# EAGLE design PCB-DISP256x64_ (EAGLE 7.5.0)

## Sheet 1 of 2
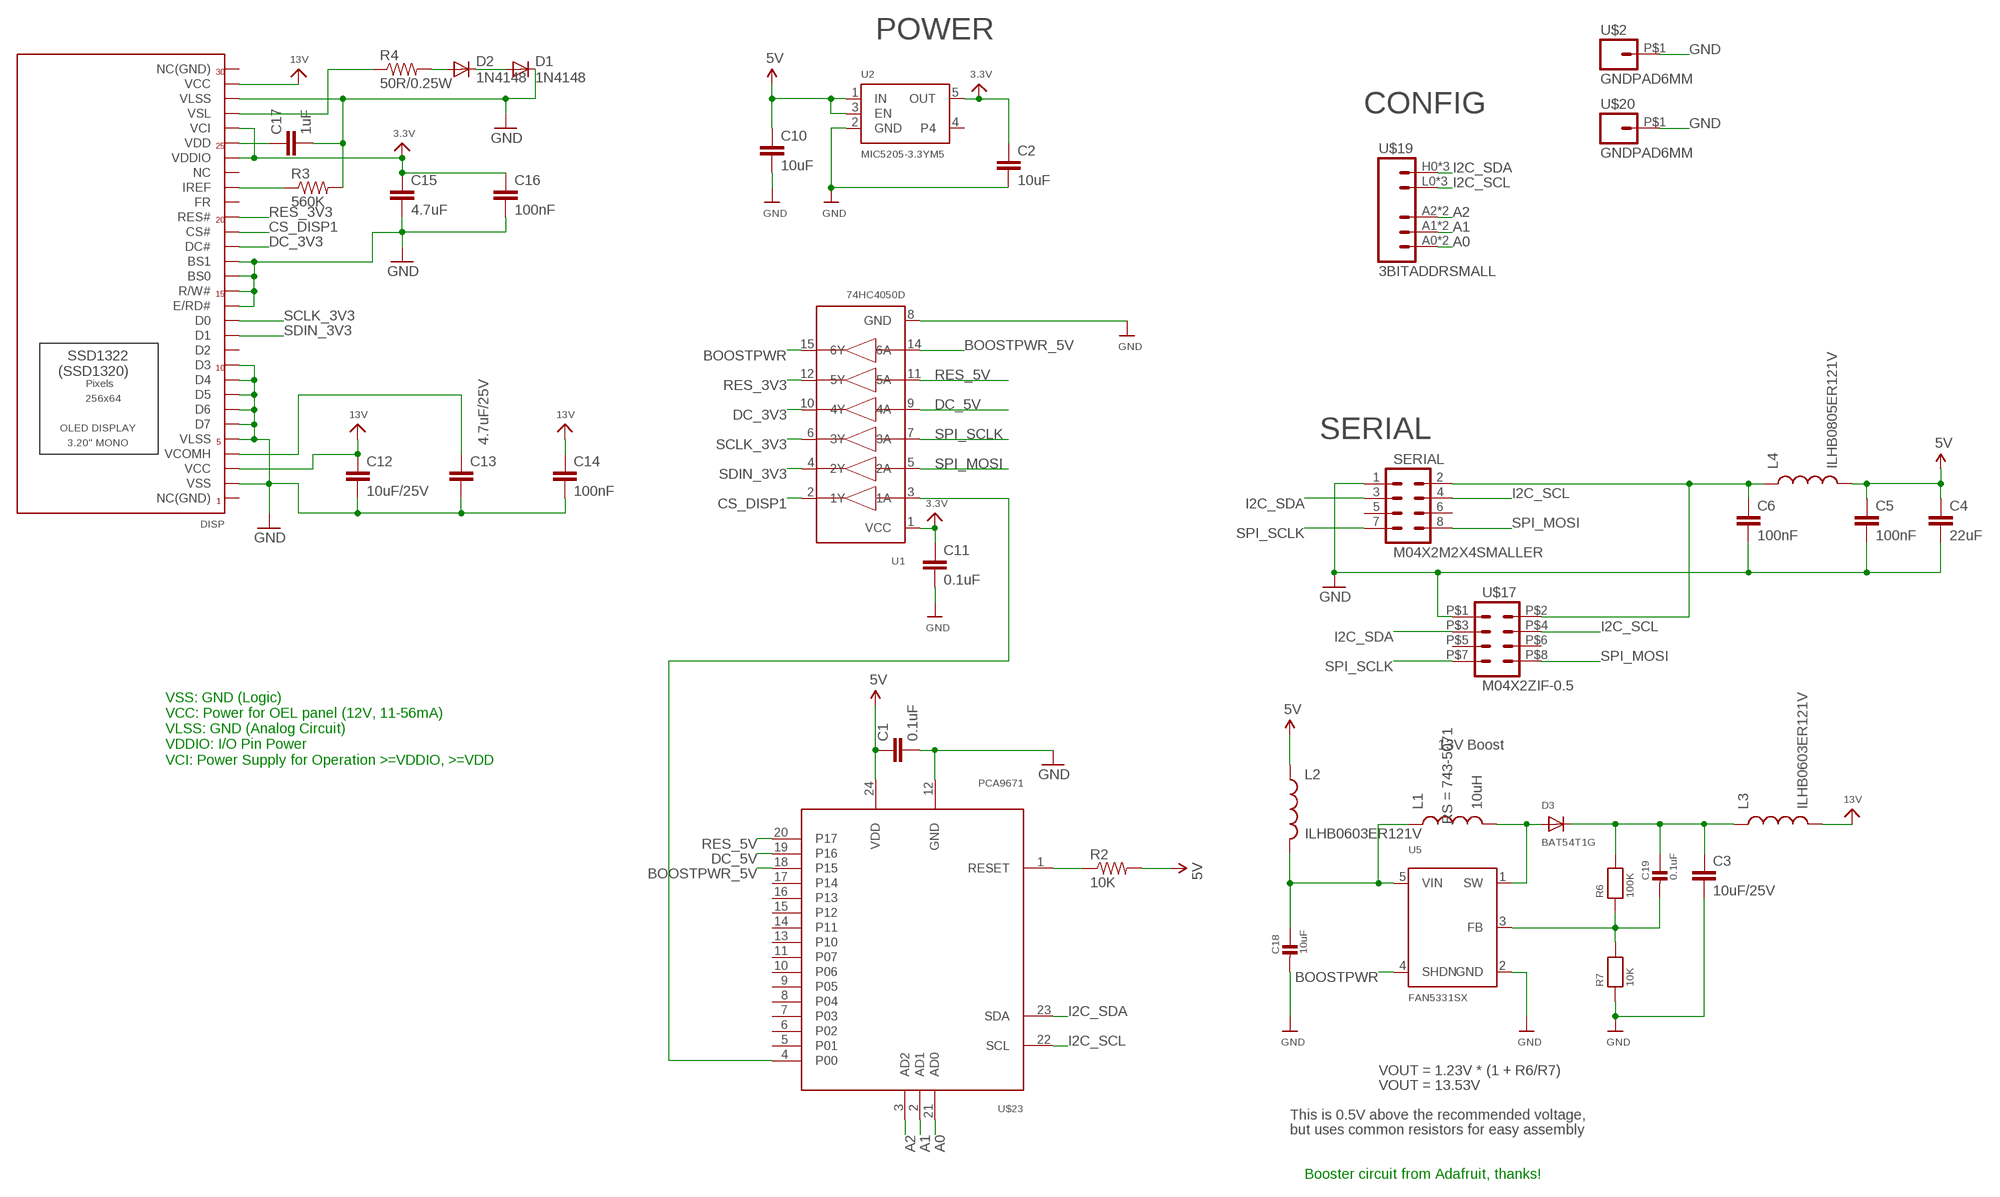
[diagram p0: schematic, sheet 1]

### Parts
C1  0.1uF  CAP0603-CAP  [0603-CAP]
C2  10uF  CAP0805  [0805]
C3  10uF/25V  CAP0805  [0805]
C4  22uF  CAP0805  [0805]
C5  100nF  CAP0603-CAP  [0603-CAP]
C6  100nF  CAP0603-CAP  [0603-CAP]
C10  10uF  CAP0805  [0805]
C11  0.1uF  CAP0603-CAP  [0603-CAP]
C12  10uF/25V  CAP0805  [0805]
C13  4.7uF/25V  CAP0805  [0805]
C14  100nF  CAP0603-CAP  [0603-CAP]
C15  4.7uF  CAP0805  [0805]
C16  100nF  CAP0603-CAP  [0603-CAP]
C17  1uF  CAP0603-CAP  [0603-CAP]
C18  10uF  CAP_CERAMIC0805  [0805]
C19  0.1uF  CAP_CERAMIC0603  [0603]
D1  1N4148  DIODESOD  [SOD-323]
D2  1N4148  DIODESOD  [SOD-323]
D3  BAT54T1G  DIODESOD-123  [SOD-123]
DISP  ER_OLED032-1TOP  [FPC_XF2M-3015-1A]
L1  10uH  POWERINDUCTOR  [3015]
L2  ILHB0603ER121V  INDUCTOR0603  [0603]
L3  ILHB0603ER121V  INDUCTOR0603  [0603]
L4  ILHB0805ER121V  INDUCTOR0805  [0805]
R2  10K  RESISTOR0603-RES  [0603-RES]
R3  560K  RESISTOR0603-RES  [0603-RES]
R4  50R/0.25W  RESISTOR0603-RES  [0603-RES]
R6  100K  RESISTOR0603  [0603]
R7  10K  RESISTOR0603  [0603]
SERIAL  M04X2M2X4SMALLER  [M2X4SMALLER]
U1  74HC4050D  74HC4050DTSSOP16  [TSSOP16]
U2  MIC5205-3.3YM5  VREG_SOT23-5  [SOT23-5]
U5  FAN5331SX  FAN5331  [SOT23-5@1]
U$2  GNDPAD6MM  [3.2MMPAD6MM]
U$17  M04X2ZIF-0.5  [ZIP-8-0.5]
U$19  3BITADDRSMALL  [3BITADDR_SMALL]
U$20  GNDPAD6MM  [3.2MMPAD6MM]
U$23  PCA9671  [TSSOP24]

### Nets
3.3V [Power]: C2.1 C11.1 C15.1 C16.1 DISP.P$5(VCI) DISP.P$7(VDDIO) U1.1(VCC) U2.5(OUT)
5V [Power]: C1.1 C4.1 C5.1 C10.1 L2.1 L4.2 R2.2 U2.1(IN) U2.3(EN) U$23.24(VDD)
13V [Power]: C12.1 C14.1 DISP.P$2(VCC) DISP.P$28(VCC) L3.2
A0: U$19.A0 U$19.AS0(A0) U$23.21(AD0)
A1: U$19.A1 U$19.AS1(A1) U$23.2(AD1)
A2: U$19.A2 U$19.AS2(A2) U$23.3(AD2)
ARD_5V [Power]: C6.1 L4.1 SERIAL.2 U$17.P$2
BOOSTPWR: U1.15(6Y) U5.4(SHDN)
BOOSTPWR_5V [Power]: U1.14(6A) U$23.18(P15)
CS_DISP1: DISP.P$12(CS#) U1.2(1Y)
DC_3V3: DISP.P$13(DC#) U1.10(4Y)
DC_5V: U1.9(4A) U$23.19(P16)
GND [Power]: C1.2 C2.2 C3.2 C4.2 C5.2 C6.2 C10.2 C11.2 C12.2 C13.2 C14.2 C15.2 C16.2 C17.2 C18.2 D1.1(C) DISP.P$3(VLSS) DISP.P$14(BS1) DISP.P$15(BS0) DISP.P$16(R/W#) DISP.P$17(E/RD#) DISP.P$21(D3) DISP.P$22(D4) DISP.P$23(D5) DISP.P$24(D6) DISP.P$25(D7) DISP.P$26(VLSS) DISP.P$29(VSS) R3.2 R7.1 SERIAL.1 U1.8(GND) U2.2(GND) U5.2(GND) U$2.P$1 U$17.P$1 U$20.P$1 U$23.12(GND)
I2C_SCL: SERIAL.4 U$17.P$4 U$19.L0(GND) U$19.L1(GND) U$19.L2(GND) U$23.22(SCL)
I2C_SDA: SERIAL.3 U$17.P$3 U$19.H0(VCC) U$19.H1(VCC) U$19.H2(VCC) U$23.23(SDA)
N$1: R2.1 U$23.1(RESET)
N$2 [Power]: C18.1 L1.1 L2.2 U5.5(VIN)
N$3: U1.3(1A) U$23.4(P00)
N$4: C3.1 C19.1 D3.C L3.1 R6.2
N$5: C13.1 DISP.P$27(VCOMH)
N$6: DISP.P$4(VSL) R4.1
N$10: DISP.P$9(IREF) R3.1
N$11: D2.2(A) R4.2
N$12: C17.1 DISP.P$6(VDD)
N$13: D1.2(A) D2.1(C)
N$14 [BoostPower]: D3.A L1.2 U5.1(SW)
N$15: C19.2 R6.1 R7.2 U5.3(FB)
RES_3V3: DISP.P$11(RES#) U1.12(5Y)
RES_5V: U1.11(5A) U$23.20(P17)
SCLK_3V3: DISP.P$18(D0) U1.6(3Y)
SDIN_3V3: DISP.P$19(D1) U1.4(2Y)
SPI_MOSI: SERIAL.8 U1.5(2A) U$17.P$8
SPI_SCLK: SERIAL.7 U1.7(3A) U$17.P$7
Unconnected: DISP.P$1(NC(GND)) DISP.P$8(NC) DISP.P$10(FR) DISP.P$20(D2) DISP.P$30(NC(GND)) SERIAL.5 SERIAL.6 U2.4 U$17.P$5 U$17.P$6 U$23.5(P01) U$23.6(P02) U$23.7(P03) U$23.8(P04) U$23.9(P05) U$23.10(P06) U$23.11(P07) U$23.13(P10) U$23.14(P11) U$23.15(P12) U$23.16(P13) U$23.17(P14)

### Notes on the sheet
- POWER
- CONFIG
- SERIAL
- 13V Boost
- VSS: GND (Logic)
  VCC: Power for OEL panel (12V, 11-56mA)
  VLSS: GND (Analog Circuit)
  VDDIO: I/O Pin Power
  VCI: Power Supply for Operation >=VDDIO, >=VDD
- VOUT = 1.23V * (1 + R6/R7)
- VOUT = 13.53V
- This is 0.5V above the recommended voltage,
- but uses common resistors for easy assembly
- Booster circuit from Adafruit, thanks!

## Sheet 2 of 2

## Library data of the parts
C1-C6 C10-C17 = SparkFun:CAP: Capacitor Standard 0603 ceramic capacitor, and 0.1" leaded capacitor.
C18 C19 = microbuilder:CAP_CERAMIC: Ceramic Capacitors For new designs, use the packages preceded by an '_' character since they are more reliable: The following footprints should be used on most boards: _0402 - Standard footprint for regular board layouts _0603 - Standard footprint for regular board layouts _0805 - Standard footprint for regular board layouts For extremely tight-pitch boards where space is at a premium, the following 'micro-pitch' footprints can be used (smaller pads, no silkscreen outline, etc.): _0402MP - Micro-pitch footprint for very dense/compact boards _0603MP - Micro-pitch footprint for very dense/compact boards _0805MP - Micro-pitch footprint for very dense/compact boards Commonly Stocked Parts 0402 - 0402 Surface Mount Capacitors 16pF 50V 5% [Digikey: 445-4899-2-ND] 18pF 50V 5% [Digikey: 490-1281-2-ND] 22pF 50V 5% [Digikey: 490-1283-2-ND] 68pF 50V 5% [Digikey: 490-1289-2-ND] 0.1uF 10V 10% [Digikey: 490-1318-2-ND] 1.0uF 6.3V 10% [Digikey: 490-1320-2-ND] 0603 - 0603 Surface Mount Capacitors 16 pF 50V 5% [Digikey: 445-5051-2-ND] 22 pF 50V [Digikey: PCC220ACVTR-ND] 33 pF 50V 5% [Digikey: 490-1415-1-ND] 56pF 50V 5% [Digikey: 490-1421-1-ND] 220pF 50V 5% [Digikey: 445-1285-1-ND] 680 pF 50V 2200 pF 50V 5% C0G [Digikey: 445-1297-1-ND] 5600 pF 100V 5% X7R [Digikey: 478-3711-1-ND] 0.1 µF 25V 10% [Digikey: PCC2277TR-ND] 0.22 µF 16V 10% X7R [Digikey: 445-1318-1-ND] 1.0 µF 25V 10% [Digikey: 445-5146-2-ND] 0603 - RF Specific 3pF 250V +/-0.1pF RF [Digikey: 712-1347-1-ND] 18 pF 250V 5% [Digikey: 478-3505-1-ND or 712-1322-1-ND] 56 pF 250V 5% C0G RF [Digikey: 490-4867-1-ND] 68 pF 250V RF [Digikey: 490-4868-1-ND] 0805 - 0805 Surface Mount Capacitors 220 pF 250V 2% RF Ceramic Capacitor [Digikey: 712-1398-1-ND] 1000 pF 50V 2% NP0 Ceramic Capacitor [Digikey: 478-3760-1-ND] 0.1 µF 25V 10% Ceramic Capacitor [Digikey: PCC1828TR-ND] 1.0 µF 16V 10% Ceramic Capacitor[Digikey: 490-1691-2-ND] 10.0 µF 10V 10% Ceramic Capacitor[Digikey: 709-1228-1-ND] 10.0 uF 16V 10% Ceramic Capacitor [Digikey: 478-5165-2-ND] 47 uF 6.3V 20% Ceramic Capacitor [Digikey: 587-1779-1-ND or 399-5506-1-ND] 1206 - 1206 Surface Mount Capacitors 47uF 10V 20% Ceramic Capacitor [Digikey: 490-5528-1-ND or 399-5508-1-ND or 445-6010-1-ND] 100uF 6.3V -20%, +80% Y5V Ceramic Capacitor (Digikey: 490-4512-1-ND, Mouser: 81-GRM31CF50J107ZE1L)
D1 D2 = SparkFun:DIODE: Diode
D3 = microbuilder:DIODE: Diode
DISP = SKAARHOJ:ER_OLED032-1: 128x128 1.5" RGB OLED - UG-2828GDEDF11 30-Pin 0.5mm Pitch FPC Cable (Top+Bottom Contacts) - OMRON XF2M-3015-1A (Digikey: OR723TR-ND) This FPC connector has contacts on the top and bottom, but the appropriate pin needs to be selected depending on whether the OLED will be inserted right-side up (use the TOP pinout) or upside-down (use the BOTTOM pinout).
L1 = SKAARHOJ:POWERINDUCTOR; RS: 743-5071
L2-L4 = SparkFun:INDUCTOR: Inductors Basic Inductor/Choke - 0603 and 1206. Footprints are not proven and vary greatly between part numbers.
R2-R4 = SparkFun:RESISTOR: Resistor Basic schematic elements and footprints for 0603, 1206, and PTH resistors.
R6 R7 = microbuilder:RESISTOR: Resistors For new designs, use the packages preceded by an '_' character since they are more reliable: The following footprints should be used on most boards: _0402 - Standard footprint for regular board layouts _0603 - Standard footprint for regular board layouts _0805 - Standard footprint for regular board layouts For extremely tight-pitch boards where space is at a premium, the following 'micro-pitch' footprints can be used (smaller pads, no silkscreen outline, etc.): _0402MP - Micro-pitch footprint for very dense/compact boards _0603MP - Micro-pitch footprint for very dense/compact boards _0805MP - Micro-pitch footprint for very dense/compact boards
SERIAL U$17 = SKAARHOJ:M04X2
U1 = SKAARHOJ:74HC4050D: 6-channel level shifter 74HC4050D - 2V-6V Supply Digikey: 74HC4050D,653-ND Mouser: 771-74HC4050D-T
U2 = microbuilder:VREG_SOT23-5: SOT23-5 Fixed Voltage Regulators To better organise some of the SOT23-5 fixed voltage regulators in this library, this new part was created. Part Current Out V Out V In V Dropout Digikey Part No. ADP121 150mA 3.3V 3.4-5.5V 0.09V @ 150mA ADP121-AUJZ33R7CT-ND ADP121 150mA 3.0V 3.1-5.5V 0.09V @ 150mA ADP121-AUJZ30R7CT-ND ADP122 300mA 3.3V 3.4-5.5V 0.085V @ 300mA ADP122AUJZ-3.3-R7CT-ND ADP1712 300mA 3.3V 3.5-5.5V 0.17V @ 300mA ADP1712AUJZ-3.3-R7TR-ND AP7311 (Low Cost) 150mA 3.3V 3.5-6V 0.15V @ 150mA AP7311-33WG-7DICT-ND LD39015M18R 150mA 1.8V 1.9V-5.5V 0.08V @ 100mA 497-6977-1-ND MCP1824T-3302E/OT 300mA 3.3V 3.5V-6V 0.2V @ 300mA MCP1824T-3302E/OTCT-ND MIC5205-2.5YM5 TR 150mA 2.5V 2.7-16V 0.165V @ 150mA 576-1257-2-ND MIC5205-3.0YM5 TR 150mA 3.0V 3.2V-16V 0.165V @ 150mA 576-1258-2-ND MIC5205-3.3YM5 TR 150mA 3.3V 3.5V-16V 0.165V @ 150mA 576-1259-2-ND TPS780330220 150mA 3.3V+2.2V 3.6-5.5V 250mV Max 296-23332-1-ND TDA3663/N1,135 100mA 3.3V 3.5-45V 0.18V @ 50mA 568-5343-1-ND
U5 = microbuilder:FAN5331: FAN5331 - LED/OLED 20V Boost Converter Digikey: FAN5331SXCT-ND
U$2 U$20 = SKAARHOJ:GNDPAD
U$19 = SKAARHOJ:3BITADDR
U$23 = SKAARHOJ:PCA9671

## Net classes
0 default: width 0.203 mm, drill 0.406 mm, clearance 0.152 mm
1 Power: width 0.305 mm, drill 0.61 mm, clearance 0.152 mm
2 BoostPower: width 0.61 mm, drill 0.61 mm, clearance 0.305 mm

## Board
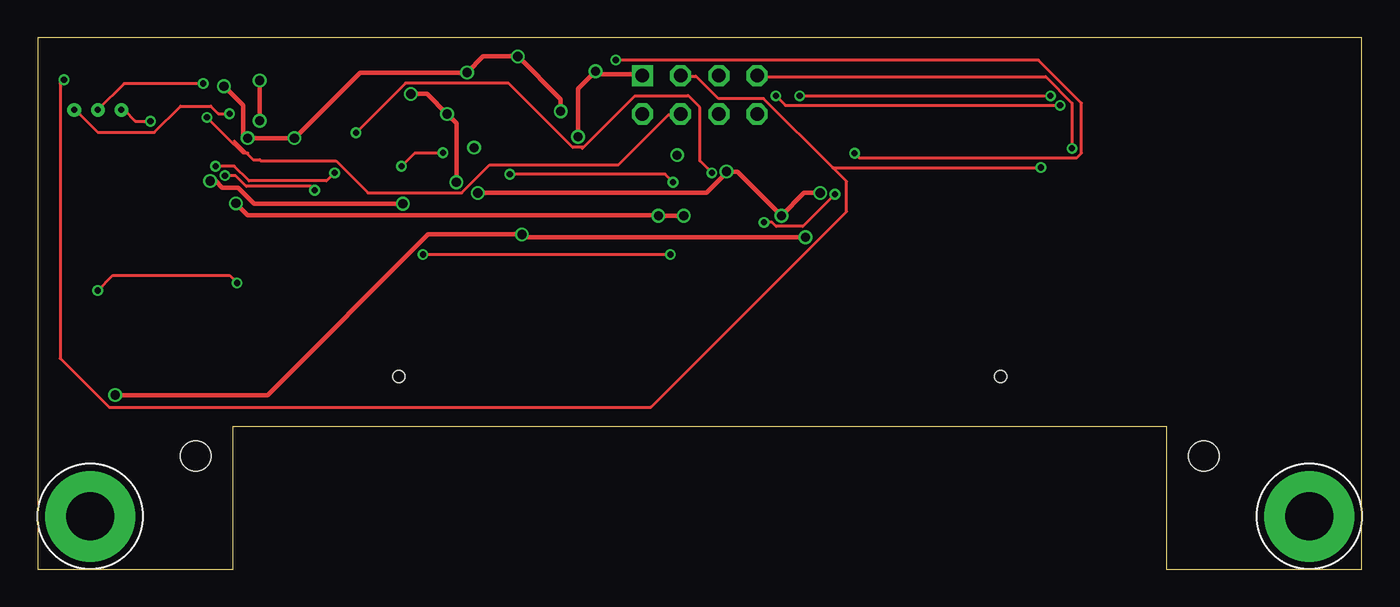
[diagram p1: board, top side]
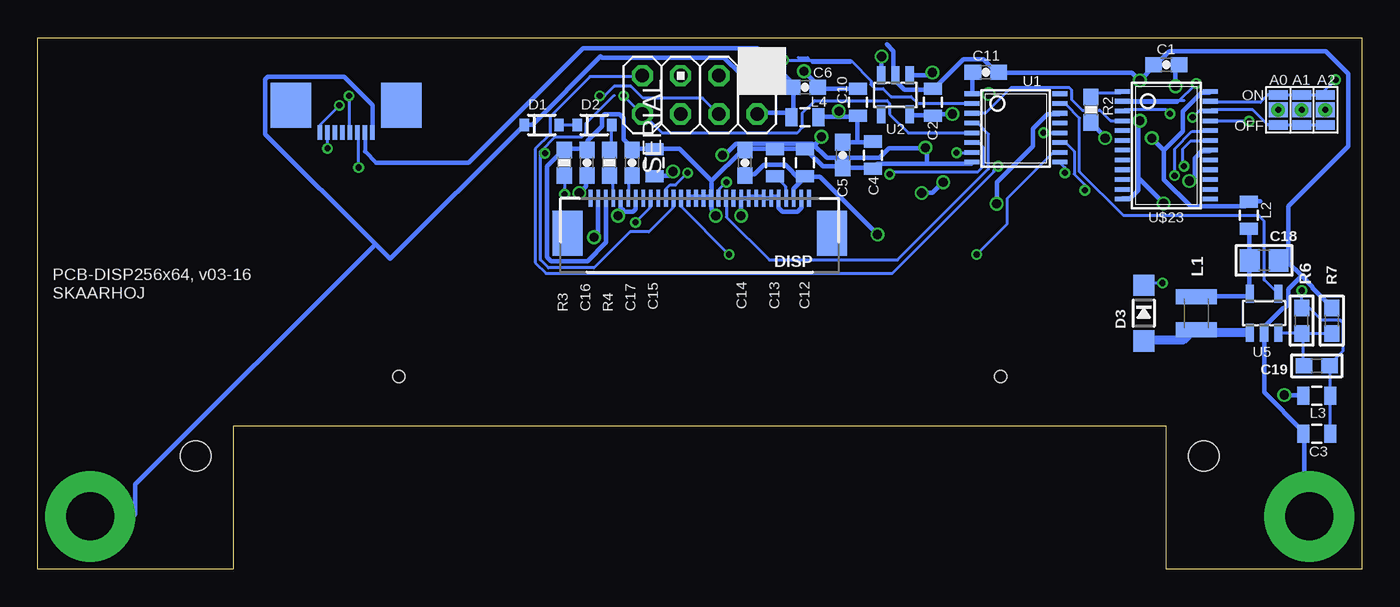
[diagram p2: board, bottom side, seen from below]

Size 88 x 35.3 mm. Coordinates in mm from the lower left corner, seen from the top.
Outline: 88,0 88,35.3 0,35.3 0,0 13,0 13,9.5 75,9.5 75,0 88,0
Copper layers (1*16): Top 0.035mm / dielectric 1.5mm / Bottom 0.035mm
Design rules "Fusion_eagle_rule_v1.1": minimum track width 6mil, minimum drill 12mil, track to track 6mil, track to pad 6mil, pad to pad 6mil, via to via 6mil, smd to smd 0mil, copper to edge 10mil, drill to drill 10mil, minimum pad ring 10mil, minimum via ring 6mil, stop-mask expansion 2mil, vias tented up to drill 100mil, thermal gap 10mil
Holes 0.8 mm at 24,12.8 64,12.8
Holes 2 mm at 10.5,7.5 77.5,7.5
tRestrict: area 9.5,14.5 to 12.5,19
bRestrict: area 9.5,14.5 to 12.5,19

### Footprints (pad centres in the part's own frame; a part is rotated, then mirrored left to right if it is on the bottom)
0603-CAP = smd 1.1 x 1: 1 -0.85,0; 2 0.85,0
0805 = smd 0.8 x 1.2: 1 -0.9,0; 2 0.9,0
0805' = smd 1.3 x 1.5: 1 -0.95,0; 2 0.95,0
0603 = smd 1.1 x 1: 1 -0.85,0; 2 0.85,0
SOD-323 = smd 0.63 x 0.83: 1 -1.15,0; 2 1.15,0
SOD-123 = smd 1.4 x 1.4: A 1.85,0; C -1.85,0
FPC_XF2M-3015-1A = smd 0.25 x 1.1: P$1 7.25,-2.63; P$2 6.75,-2.63; P$3 6.25,-2.63; P$4 5.75,-2.63; P$5 5.25,-2.63; P$6 4.75,-2.63; P$7 4.25,-2.63; P$8 3.75,-2.63; P$9 3.25,-2.63; P$10 2.75,-2.63; P$11 2.25,-2.63; P$12 1.75,-2.63; P$13 1.25,-2.63; P$14 0.75,-2.63; P$15 0.25,-2.63; P$16 -0.25,-2.63; P$17 -0.75,-2.63; P$18 -1.25,-2.63; P$19 -1.75,-2.63; P$20 -2.25,-2.63; P$21 -2.75,-2.63; P$22 -3.25,-2.63; P$23 -3.75,-2.63; P$24 -4.25,-2.63; P$25 -4.75,-2.63; P$26 -5.25,-2.63; P$27 -5.75,-2.63; P$28 -6.25,-2.63; P$29 -6.75,-2.63; P$30 -7.25,-2.63 | smd 2 x 3: SUPPORT1 8.79,-0.305; SUPPORT2 -8.79,-0.305
3015 = smd 1 x 2.7: 1 -1.1,0; 2 1.1,0
0603-RES = smd 1.1 x 1: 1 -0.85,0; 2 0.85,0
M2X4SMALLER = drill 0.9 square: 1 -1.27,3.81 | drill 0.9 octagon: 2 1.27,3.81; 3 -1.27,1.27; 4 1.27,1.27; 5 -1.27,-1.27; 6 1.27,-1.27; 7 -1.27,-3.81; 8 1.27,-3.81
TSSOP16 = smd 0.305 x 0.991: 1 -3.575,-2.918; 2 -2.925,-2.918; 3 -2.275,-2.918; 4 -1.625,-2.918; 5 -0.975,-2.918; 6 -0.325,-2.918; 7 0.325,-2.918; 8 0.975,-2.918; 9 0.975,2.918; 10 0.325,2.918; 11 -0.325,2.918; 12 -0.975,2.918; 13 -1.625,2.918; 14 -2.275,2.918; 15 -2.925,2.918; 16 -3.575,2.918
SOT23-5 = smd 0.55 x 1.2: 1 -0.95,-1.3; 2 0,-1.3; 3 0.95,-1.3; 4 0.95,1.3; 5 -0.95,1.3
SOT23-5@1 = smd 0.55 x 1.2: 1 -0.95,-1.3; 2 0,-1.3; 3 0.95,-1.3; 4 0.95,1.3; 5 -0.95,1.3
3.2MMPAD6MM = drill 3.2 pad 6: P$1 0,0
ZIP-8-0.5 = smd 2.7 x 3: GND$1 3.68,-1.8; GND$9 -3.68,-1.8 | smd 0.3 x 0.96: P$1 -1.75,0; P$2 -1.25,0; P$3 -0.75,0; P$4 -0.25,0; P$5 0.25,0; P$6 0.75,0; P$7 1.25,0; P$8 1.75,0
3BITADDR_SMALL = drill 0.4: A0 -1.565,0; A1 0,0; A2 1.565,0 | smd 1.27 x 1: AS0 -1.565,0; AS1 0,0; AS2 1.565,0 | smd 1.27 x 0.635: H0 -1.565,1; H1 0,1; H2 1.565,1; L0 -1.565,-1; L1 0,-1; L2 1.565,-1
TSSOP24 = smd 0.305 x 0.991: 1 -4.225,-2.918; 2 -3.575,-2.918; 3 -2.925,-2.918; 4 -2.275,-2.918; 5 -1.625,-2.918; 6 -0.975,-2.918; 7 -0.325,-2.918; 8 0.325,-2.918; 9 0.975,-2.918; 10 1.625,-2.918; 11 2.275,-2.918; 12 2.925,-2.918; 13 2.925,2.918; 14 2.275,2.918; 15 1.625,2.918; 16 0.975,2.918; 17 0.325,2.918; 18 -0.325,2.918; 19 -0.975,2.918; 20 -1.625,2.918; 21 -2.275,2.918; 22 -2.925,2.918; 23 -3.575,2.918; 24 -4.225,2.918

### Placement (x,y rotation side)
C1  13,33.5 180 bottom
C2  28.5,31 90 bottom
C3  3,9 180 bottom
C4  32.5,27.5 270 bottom
C5  34.5,27.5 270 bottom
C6  37,32 0 bottom
C10  33.5,31 90 bottom
C11  25,33 0 bottom
C12  37,27 90 bottom
C13  39,27 90 bottom
C14  41,27 90 bottom
C15  47,27 90 bottom
C16  51.5,27 90 bottom
C17  48.5,27 90 bottom
C18  10uF  [0805']  6.5,20.5 0 bottom
C19  3,13.5 180 bottom
D1  54.5,29.5 0 bottom
D2  51,29.5 0 bottom
D3  14.5,17 270 bottom
DISP  44,22 180 bottom
L1  11,17 270 bottom
L2  ILHB0603ER121V  [0805]  7.5,23.5 270 bottom
L3  ILHB0603ER121V  [0805]  3,11.5 180 bottom
L4  37,30 0 bottom
R2  18,30.5 270 bottom
R3  53,27 90 bottom
R4  50,27 90 bottom
R6  4,16.5 90 bottom
R7  2,16.5 270 bottom
SERIAL  44,31.5 270 bottom
U1  23,28 270 bottom
U2  31,31.5 180 bottom
U5  6.5,17 0 bottom
U$2  3.5,3.5 0 top
U$17  67.5,29 180 bottom
U$19  4,30.5 0 bottom
U$20  84.5,3.5 0 top
U$23  13,27.5 270 bottom

### Tracks (layer width: path | path; a pad name or v marks a point on that pad's centre or on a via)
3.3V  (via drill 0.61)
  Top 0.305: v52.01,24.98 50.94,24.98 v49.43,23.47 46.49,26.4 v45.78,26.4 45.52,26.14 45.52,26.05 44.45,24.98 v29.25,24.98 | v24.8,31.56 25.87,31.56 v27.2,30.23 27.83,29.6 v27.83,25.69
  Bottom 0.305: 49.07,23.82 49.25,24 DISP.P$5 | 49.07,23.82 48.98,23.74 48.45,23.74 48.27,23.91 48.27,24.62 DISP.P$7 | v52.01,24.98 51.56,25.43 51.56,26.14 C16.1 | 49.07,23.82 v49.43,23.47 | v45.78,26.4 46.05,26.14 46.94,26.14 C15.1 | C11.1 25.87,32.98 25.87,31.65 U1.1 25.78,31.56 v24.8,31.56 | U2.5 30.05,30.14 28.54,30.14 C2.1 28.45,30.23 v27.2,30.23 | v29.25,24.98 28.54,24.98 v27.83,25.69
5V  (via drill 0.61)
  Top 0.305: v34.76,30.4 34.76,31.2 v31.91,34.05 29.6,34.05 v28.54,32.98 21.43,32.98 v17.07,28.63 v13.96,28.63 13.65,28.89 13.65,30.8 v12.38,32.07
  Bottom 0.305: 33.52,28.36 32.54,28.36 C4.1 | 33.52,28.36 C5.1 | 33.52,28.36 33.52,30.05 C10.1 33.6,30.05 34.76,30.05 | 34.76,30.05 36.09,30.05 L4.2 | 13.16,27.83 11.91,29.07 11.91,30.4 10.67,31.65 10.13,31.65 U$23.24 | 13.16,27.83 13.16,25.87 11.38,24.09 7.73,24.09 7.56,24.27 L2.1 7.38,24.45 6.76,24.45 | v17.07,28.63 17.07,28.71 17.96,29.6 R2.2 | 13.16,27.83 v13.96,28.63 | 12.09,33.52 C1.1 12.38,33.34 v12.38,32.07 | v28.54,32.98 28.71,32.8 U2.1 | v31.91,34.05 31.91,32.8 U2.3 | v34.76,30.4 34.76,30.05
13V  (via drill 0.61)
  Top 0.305: v5.16,11.56 15.29,11.56 25.96,22.23 v32.18,22.23 32.36,22.05 v51.03,22.05
  Bottom 0.305: v5.16,11.56 3.91,11.56 L3.2 | v32.18,22.23 36.01,26.05 36.98,26.05 C12.1 | DISP.P$28 37.78,24.71 37.78,25.25 37.07,25.96 C12.1 | C14.1 40.98,26.23 40.36,26.23 39.74,26.85 38.32,26.85 37.34,25.87 C12.1 | v51.03,22.05 50.76,22.31 50.76,24.62 DISP.P$2
A0  (via drill 0.41)
  Top 0.203: v7.5,29.75 6.5,29.75 5.75,30.5 U$19.AS0
  Bottom 0.203: v7.5,29.75 10,29.75 U$23.21 | 5.5,30.5 U$19.AS0
A1  (via drill 0.41)
  Top 0.203: U$19.AS1 5.75,32.25 v11,32.25
  Bottom 0.203: 11.82,31.11 15.91,31.11 U$23.2 15.75,31 12.25,31 v11,32.25
A2  (via drill 0.41)
  Top 0.203: v12.75,30.25 12,30.25 11.5,30.75 9.5,30.75 7.75,29 4,29 2.5,30.5 U$19.AS2
  Bottom 0.203: v12.75,30.25 13,30.5 15.75,30.5 U$23.3 | 2.5,30.5 U$19.AS2
ARD_5V
  Bottom 0.254: U$17.P$2 66.25,27.75 65.5,27
  Bottom 0.305: 37.78,30.32 37.78,30 L4.1 37.78,30.32 | 37.78,30.32 37.78,31.91 C6.1 37.94,32.07 37.94,32.38 40.16,34.61 51.75,34.61 59.37,26.99 65.41,26.99 65.5,27 | 37.78,30.32 40.16,30.32 SERIAL.2
BOOSTPWR
  Bottom 0.203: U1.15 20,30.85 19.65,30.85 18.76,29.96 18.76,26.4 15.82,23.47 6.84,23.47 6.49,23.11 6.49,19.2 5.6,18.31 U5.4
BOOSTPWR_5V  (via drill 0.61)
  Top 0.305: v11.47,25.78 11.82,25.78 12.27,25.34 13.34,25.34 14.4,24.27 v24.27,24.27
  Bottom 0.305: v11.47,25.78 11.11,26.14 11.11,27.29 10.67,27.74 10.13,27.74 U$23.18 | v24.27,24.27 24.27,25.69 21.87,28.09 21.87,29.25 20.89,30.23 20.09,30.23 U1.14
CS_DISP1  (via drill 0.41)
  Top 0.203: v38.42,33.81 66.52,33.81 69.37,30.96 69.37,27.62 69.06,27.3 54.61,27.3 v54.29,27.62
  Bottom 0.203: 33.9,33.73 33.96,33.78 37.47,33.78 | 33.9,33.73 32.63,32.45 32.63,32.18 32.36,31.91 31.83,31.91 31.29,31.38 29.96,31.38 29.52,30.94 25.96,30.94 U1.2 | 37.52,33.78 37.47,33.78 | 49.7,31.47 51.56,29.6 51.56,28.98 51.83,28.71 53.61,28.71 54.5,27.83 | 54.5,27.83 54.59,27.74 54.59,20.54 54.05,20 51.03,20 48.63,22.4 47.38,22.4 45.78,24 45.78,24.62 DISP.P$12 | 37.47,33.97 36.83,33.97 36.51,33.66 33.97,33.66 33.9,33.73 | v38.42,33.81 37.47,33.81 37.47,33.78 | 54.5,27.83 v54.29,27.62
DC_3V3  (via drill 0.41)
  Top 0.203: v42.05,20.89 v25.6,20.89
  Bottom 0.203: v25.6,20.89 23.56,22.94 23.56,24.62 20.54,27.65 20.09,27.65 U1.10 | v42.05,20.89 45.25,24.09 DISP.P$13
DC_5V  (via drill 0.41)
  Top 0.203: v11.82,26.76 13.07,26.76 14.05,25.78 19.2,25.78 v19.74,26.31
  Bottom 0.203: v11.82,26.76 11.91,26.85 11.91,27.91 11.38,28.45 10.13,28.45 U$23.19 | v19.74,26.31 19.74,26.67 20,26.94 U1.9
GND  (via drill 0.6, 0.61)
  Top 0.305: v42.94,23.47 v41.25,23.47 41.12,23.5 13.97,23.5 v13.18,24.29 | v14.76,32.45 v14.76,29.78 | v35.92,28.71 35.92,31.91 v37.07,33.07 36.99,32.86 40.16,32.86 SERIAL.1
  Bottom 0.305: 4.98,20.45 4,19.47 | 4,19.47 3.29,18.76 3.29,18.67 2.04,17.42 R7.1 | 4.98,20.45 5.51,20.45 C18.2 | 4,19.47 4.89,18.58 4.89,17.6 5.16,17.34 5.25,17.34 6.49,16.09 6.49,15.73 U5.2 6.49,15.56 6.49,11.73 3.91,9.16 C3.2 3.82,8.98 3.82,3.82 U$2.P$1 | DISP.P$3 50.23,24.62 50.23,21.69 51.47,20.45 53.87,20.45 54.14,20.71 54.14,26.76 53.07,27.83 R3.2 52.9,27.91 51.56,27.91 C16.2 51.47,28 51.47,28.45 50.49,29.43 50.49,30.05 50.32,30.23 49.34,30.23 49.07,29.96 49.07,28.54 48.54,28 C17.2 48.45,27.91 47.03,27.91 C15.2 46.85,27.91 45.34,27.91 43.2,25.78 | 28.89,26.94 32.18,26.94 32.45,26.67 C4.2 32.63,26.67 34.49,26.67 C5.2 34.58,26.76 35.83,26.76 36.89,27.83 C12.2 | 28.89,26.94 25.96,26.94 U1.8 | DISP.P$29 37.25,24 37.52,23.74 38.49,23.74 38.76,24 DISP.P$26 38.85,24.71 39.2,24.71 DISP.P$25 39.38,24.62 39.65,24.62 DISP.P$24 39.83,24.71 40.18,24.71 DISP.P$23 40.36,24.71 40.72,24.71 DISP.P$22 40.89,24.62 DISP.P$21 41.25,24.54 v41.25,23.47 | DISP.P$17 43.29,24.71 43.74,24.71 DISP.P$16 43.83,24.71 44.18,24.71 DISP.P$15 44.36,24.71 44.72,24.71 DISP.P$14 | C12.2 37.07,27.91 38.85,27.91 C13.2 39.03,27.91 40.98,27.91 C14.2 41.16,27.83 43.2,25.78 | 43.2,25.78 43.2,24.8 DISP.P$17 | v42.94,23.47 42.94,23.65 43.2,23.91 43.2,24.54 DISP.P$17 | 14.85,25.88 14.85,29.69 v14.76,29.78 | 14.85,25.88 14.85,25.16 15.38,24.62 15.91,24.62 U$23.12 | C10.2 33.52,31.91 36.09,31.91 C6.2 36.27,32.09 36.27,32.27 v37.07,33.07 | 31.56,34.85 31.11,34.4 31.11,32.89 U2.2 30.94,32.72 30.94,32.36 30.4,31.83 28.63,31.83 C2.2 28.45,31.91 26.49,33.87 25.16,33.87 24.36,33.07 24.18,33.07 C11.2 24,32.98 15.29,32.98 v14.76,32.45 13.78,33.43 C1.2 13.69,33.52 12.8,34.4 2.4,34.4 0.89,32.89 0.89,28.09 4.89,24.09 4.89,20.54 4.98,20.45
  Bottom 0.305: U$20.P$1 84.45,3.56 81.61,3.56 81.5,3.62 81.5,5.62 65.55,21.58 | v35.92,28.71 35.92,28.63 36.72,27.83 C12.2 | 28.89,26.94 28.89,27.94 v29,28 29.21,27.94 31.43,27.94 32.07,27.3 35.56,27.3 36.51,28.26 41.59,28.26 42.23,27.62 v42.5,27.5 | 65.55,21.58 64.57,20.6 55.74,29.43 D1.1 55.56,29.52 55.12,29.52 50.58,34.05 50.48,33.97 42.39,33.97 41.27,32.86 40.32,32.86 SERIAL.1 | 65.55,21.58 72.87,28.89 72.87,32.54 72.71,32.7 67.63,32.7 65.72,30.8 65.72,29.05 U$17.P$1 | v13.18,24.29 14.76,25.88 14.85,25.88
I2C_SCL  (via drill 0.41)
  Top 0.203: 38.58,26.85 30.05,26.85 28.18,24.98 21.96,24.98 19.82,27.11 14.85,27.11 14.76,27.2 14.31,27.2 13.93,27.58 | 38.58,26.85 | 13.07,28.45 13.93,27.58 | 13.93,27.58 13.97,27.62 13.65,27.62 13.02,28.26 13,28.25 v11.25,30 | v50.64,31.43 v67.31,31.43 | SERIAL.4 42.7,30.16 41.91,30.16 38.58,26.83 38.58,26.85
  Bottom 0.203: U$19.L2 U$19.L1 U$19.L0 6.25,29.5 7.25,30.5 10,30.5 U$23.22 10.25,30.5 10.75,30.5 v11.25,30 | v67.31,31.43 67.31,29.05 U$17.P$4 | v50.64,31.43 50.32,31.43 49.69,32.07 48.58,32.07 47.78,31.27 43.81,31.27 42.86,30.32 SERIAL.4
I2C_SDA  (via drill 0.41)
  Top 0.203: 52.85,26.65 53.75,25.75 53.75,23.75 40.75,10.75 4.75,10.75 1.5,14 1.5,32.25 v1.75,32.5 | 52.85,26.65 48.25,31.25 45.25,31.25 43.75,32.75 43.66,32.7 42.86,32.7 SERIAL.3 | v66.67,26.67 52.86,26.67 52.85,26.65
  Bottom 0.203: 2.75,31.5 U$19.H1 U$19.H0 6.25,31.5 6.75,31 10,31 U$23.23 | 2.75,31.5 v1.75,32.5 | 2.75,31.5 U$19.H2 | v66.67,26.67 66.67,28.89 U$17.P$3
N$1
  Bottom 0.203: U$23.1 16,31.65 17.69,31.65 17.96,31.38 R2.1
N$2
  Bottom 0.305: L2.2 7.47,22.58 7.47,20.54 C18.1 7.47,20.36 7.47,18.31 U5.5 7.56,18.22 7.64,18.14 10.94,18.14 L1.1
N$3
  Bottom 0.203: U$23.4 16,29.78 16.71,29.78 17.42,30.49 18.58,30.49 19.29,31.2 19.29,31.83 19.47,32 23.29,32 24.98,30.32 25.87,30.32 U1.3
N$4  (via drill 0.41)
  Top 0.203: v13.25,19 12.75,19.5 5,19.5 v4,18.5
  Bottom 0.203: C3.1 2.13,9.07 2.13,11.47 L3.1 2.13,11.56 2.13,13.42 C19.1 2.13,13.6 1.25,14.49 1.25,16.36 1.42,16.54 2.67,16.54 3.47,17.34 3.91,17.34 R6.2 v4,18.5 | v13.25,19 14.5,19 D3.C
N$5
  Bottom 0.203: DISP.P$27 38.32,24.71 38.32,25.43 38.94,26.05 C13.1
N$6
  Bottom 0.203: DISP.P$4 49.78,24.71 49.78,25.96 49.96,26.14 R4.1
N$10  (via drill 0.41)
  Top 0.203: v48.27,23.02 48.81,23.02 49.07,22.76 50.85,22.76 v52.98,24.89
  Bottom 0.203: v48.27,23.02 47.3,24 47.3,24.62 DISP.P$9 | v52.98,24.89 52.98,26.14 R3.1
N$11
  Bottom 0.203: D2.2 49.87,29.43 49.87,28 49.96,27.91 R4.2
N$12
  Bottom 0.203: DISP.P$6 48.72,24.71 48.72,25.96 48.54,26.14 C17.1
N$13
  Bottom 0.203: D2.1 52.18,29.52 53.34,29.52 D1.2
N$14
  Bottom 0.61: U5.1 7.47,15.73 10.85,15.73 10.94,15.82 L1.2 11.29,15.82 11.91,15.2 14.49,15.2 D3.A
N$15
  Bottom 0.203: C19.2 3.91,13.51 3.91,15.65 R6.1 | R7.2 2.04,15.65 3.82,15.65 R6.1 | U5.3 5.51,15.65 4.09,15.65 R6.1
RES_3V3  (via drill 0.41)
  Top 0.203: v21.16,28.98 24.45,32.27 31.29,32.27 35.56,28 36.2,28 | 36.27,28 36.2,28 | 43.21,31.46 44.01,30.67 44.01,27.11 v44.81,26.31 | 43.21,31.46 43.2,31.47 | 43.21,31.46 43.18,31.43 39.69,31.43 36.2,27.94 36.2,28
  Bottom 0.203: v21.16,28.98 20.09,28.98 U1.12 | v44.81,26.31 45.61,25.51 45.96,25.51 46.23,25.25 46.23,24.71 DISP.P$11
RES_5V  (via drill 0.41)
  Top 0.203: v12.45,26.14 13.16,26.14 13.87,25.43 18.14,25.43 v18.4,25.16
  Bottom 0.203: v12.45,26.14 12.45,27.91 11.29,29.07 10.13,29.07 U$23.20 | v18.4,25.16 18.4,25.51 19.11,26.23 19.11,27.74 19.65,28.27 20,28.27 U1.11
SCLK_3V3  (via drill 0.41)
  Top 0.203: v31.38,26.23 41.69,26.23 v42.23,25.69
  Bottom 0.203: v31.38,26.23 31.2,26.4 25.51,26.4 25.16,26.76 25.16,28 25.43,28.27 25.87,28.27 U1.6 | v42.23,25.69 42.67,25.25 42.67,24.71 DISP.P$18
SDIN_3V3
  Bottom 0.203: U1.4 25.87,29.6 25.51,29.6 24.8,28.89 24.8,26.58 30.85,20.54 39.38,20.54 42.23,23.38 42.23,24.62 DISP.P$19
SPI_MOSI  (via drill 0.41)
  Top 0.203: v67.94,30.8 49.69,30.8 v49.05,31.43
  Bottom 0.203: U1.5 25.96,28.98 30.14,28.98 31.38,30.23 31.38,30.94 31.56,31.11 36.36,31.11 37.16,30.32 37.16,29.34 37.52,28.98 46.49,28.98 47.74,30.23 SERIAL.8 47.94,30.32 v49.05,31.43 | v67.94,30.8 69.22,29.53 69.22,29.05 U$17.P$8
SPI_SCLK  (via drill 0.41)
  Top 0.203: v26.94,27.65 25.07,27.65 v24.18,26.76 | v68.74,27.94 68.74,30.96 66.99,32.7 47.94,32.7 SERIAL.7
  Bottom 0.203: v26.94,27.65 25.96,27.65 U1.7 | v24.18,26.76 24.45,26.49 24.45,26.4 31.2,19.65 54.23,19.65 54.94,20.36 54.94,27.91 53.96,28.89 53.96,30.05 51.3,32.72 47.83,32.72 SERIAL.7 | v68.74,27.94 68.74,28.89 U$17.P$7

### Text on the board
_bsilk: PCB-DISP256x64, v03-16 / SKAARHOJ